# Altium schematic sheet obc-db.SchDoc
size 297 x 209 mm
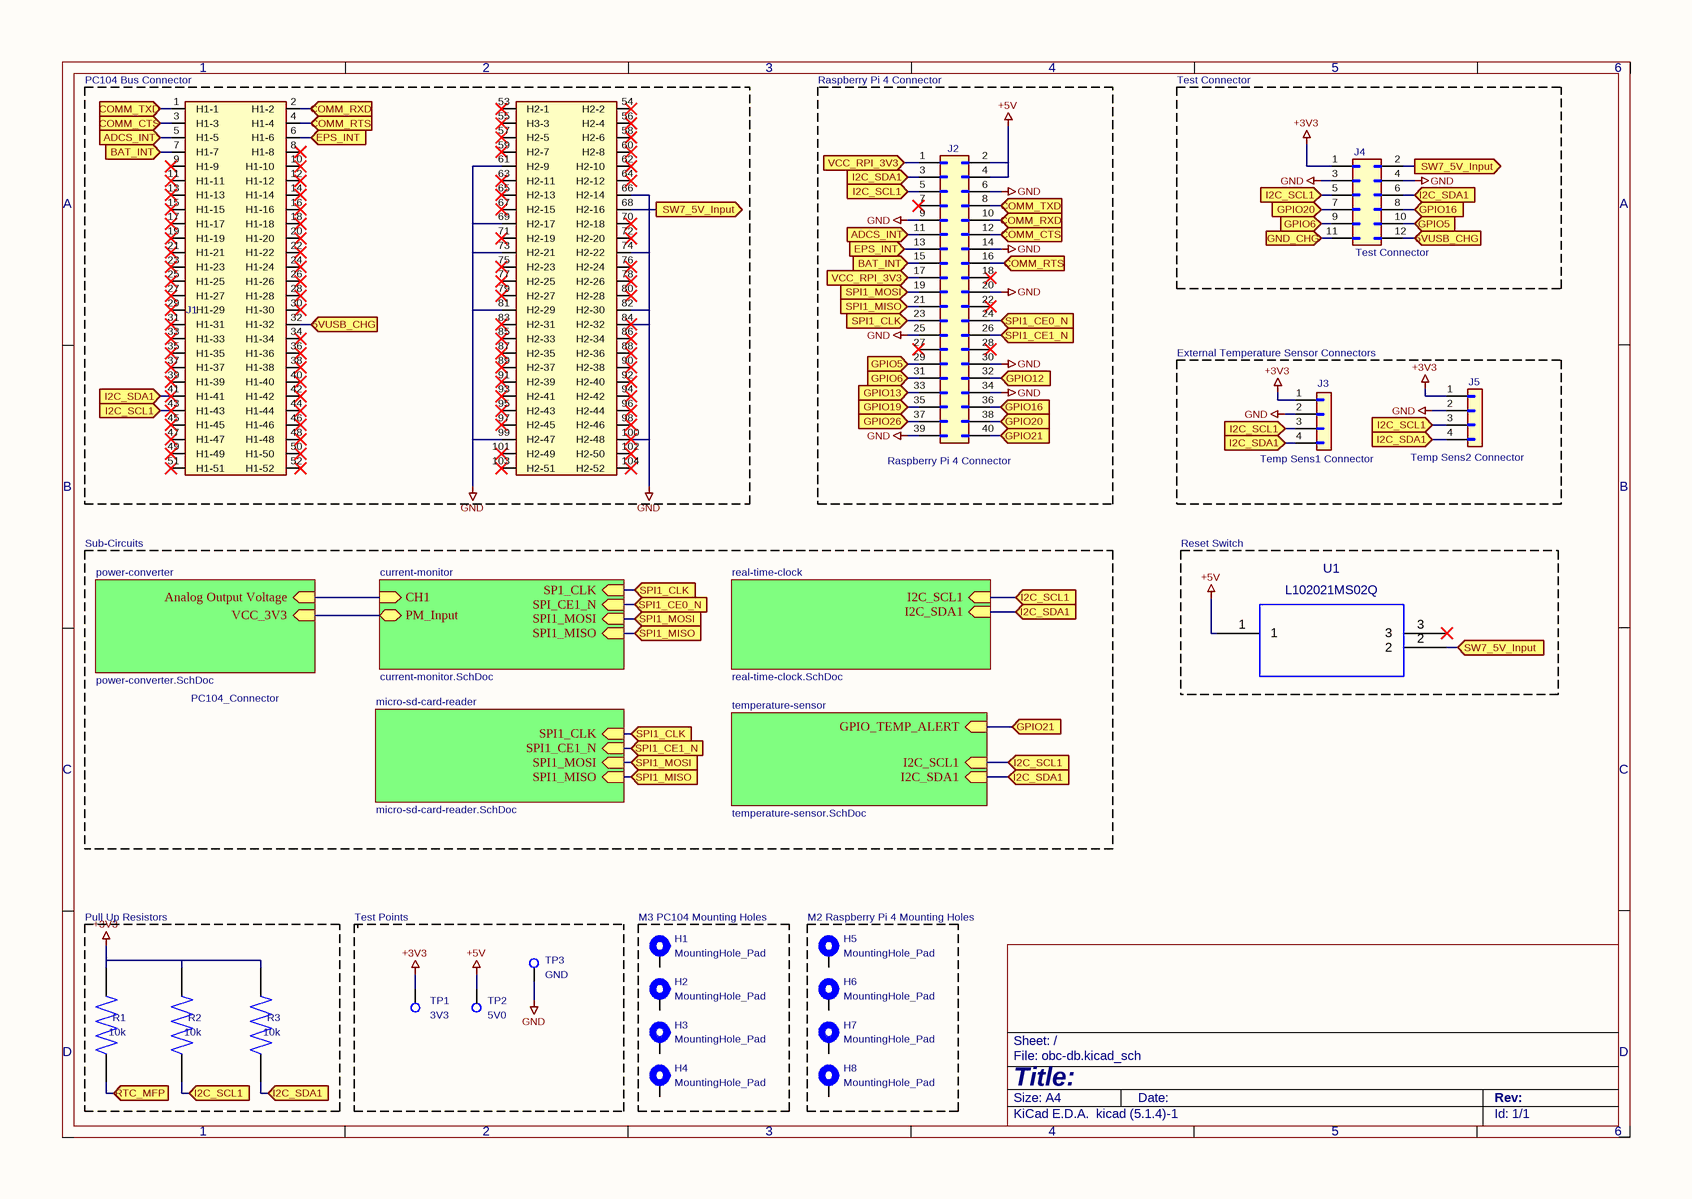
[diagram p0: obc-db.SchDoc]

## Parts
H1  MountingHole_Pad  [MountingHole_3.2mm_M3_Pad_TopBottom]
H2  MountingHole_Pad  [MountingHole_3.2mm_M3_Pad_TopBottom]
H3  MountingHole_Pad  [MountingHole_3.2mm_M3_Pad_TopBottom]
H4  MountingHole_Pad  [MountingHole_3.2mm_M3_Pad_TopBottom]
H5  MountingHole_Pad  [MountingHole_2.2mm_M2_Pad_TopBottom]
H6  MountingHole_Pad  [MountingHole_2.2mm_M2_Pad_TopBottom]
H7  MountingHole_Pad  [MountingHole_2.2mm_M2_Pad_TopBottom]
H8  MountingHole_Pad  [MountingHole_2.2mm_M2_Pad_TopBottom]
J1  PC104_Connector  [pc104-connector]
J2  Raspberry Pi 4 Connector  [PinSocket_2x20_P2.54mm_Vertical]
J3  Temp Sens1 Connector  [PinHeader_1x04_P2.54mm_Vertical]
J4  Test Connector  [PinSocket_2x06_P2.54mm_Horizontal]
J5  Temp Sens2 Connector  [PinHeader_1x04_P2.54mm_Vertical]
R1  10k  [R_0603_1608Metric]
R2  10k  [R_0603_1608Metric]
R3  10k  [R_0603_1608Metric]
TP1  3V3  [TestPoint_Pad_2.0x2.0mm]
TP2  5V0  [TestPoint_Pad_2.0x2.0mm]
TP3  GND  [TestPoint_Pad_2.0x2.0mm]
U1  L102021MS02Q  [L102021MS02Q]

## Blocks framed on the sheet
PC104 Bus Connector: J1
Test Connector: J4
External Temperature Sensor Connectors /: J3 J5
Reset Switch: U1
Pull Up Resistors: R1-R3
Test Points: TP1-TP3
M3 PC104 Mounting Holes /: H1-H4
M2 Raspberry Pi 4 Mounting Holes /: H5-H8

## Sub-sheets
current-monitor = current-monitor.SchDoc: CH1 (in), SPI1_MISO (in), SPI1_MOSI (in), SPI_CE1_N (in), SP1_CLK (in), PM_Input (bidir)
micro-sd-card-reader = micro-sd-card-reader.SchDoc: SPI1_CLK (in), SPI1_MOSI (in), SPI1_MISO (in), SPI1_CE1_N (in)
power-converter = power-converter.SchDoc: Analog Output Voltage (in), VCC_3V3 (in)
real-time-clock = real-time-clock.SchDoc: I2C_SCL1 (in), I2C_SDA1 (in)
temperature-sensor = temperature-sensor.SchDoc: GPIO_TEMP_ALERT (in), I2C_SDA1 (in), I2C_SCL1 (in)

## Ports
5VUSB_CHG (in), ADCS_INT (in), BAT_INT (in), COMM_CTS (in), COMM_RTS (in), COMM_RXD (in), COMM_TXD (in), EPS_INT (in), GND_CHG (in), GPIO5 (in), GPIO6 (in), GPIO12 (in), GPIO13 (in), GPIO16 (in), GPIO19 (in), GPIO20 (in), GPIO21 (in), GPIO26 (in), I2C_SCL1 (in), I2C_SDA1 (in), RTC_MFP (in), SPI1_CE0_N (in), SPI1_CE1_N (in), SPI1_CLK (in), SPI1_MISO (in), SPI1_MOSI (in), SW7_5V_Input (in), SW7_5V_Input (out), VCC_RPI_3V3 (in)

## Nets
+3V3: J3.1(Pin_1) J4.1(Pin_1) J5.1(Pin_1) R1.1 R2.1 R3.1 TP1.1
+5V: J2.2(Pin_2) J2.4(Pin_4) TP2.1 U1.1
GND: J1.61(H2-9) J1.66(H2-14) J1.69(H2-17) J1.73(H2-21) J1.74(H2-22) J1.81(H2-29) J1.82(H2-30) J1.84(H2-32) J1.99(H2-47) J1.100(H2-48) J2.6(Pin_6) J2.9(Pin_9) J2.14(Pin_14) J2.20(Pin_20) J2.25(Pin_25) J2.30(Pin_30) J2.34(Pin_34) J2.39(Pin_39) J3.2(Pin_2) J4.3(Pin_3) J4.4(Pin_4) J5.2(Pin_2) TP3.1
5VUSB_CHG: J1.32(H1-32) J4.12(Pin_12) ; port 5VUSB_CHG
ADCS_INT: J1.5(H1-5) J2.11(Pin_11) ; port ADCS_INT
BAT_INT: J1.7(H1-7) J2.15(Pin_15) ; port BAT_INT
COMM_CTS: J1.3(H1-3) J2.12(Pin_12) ; port COMM_CTS
COMM_RTS: J1.4(H1-4) J2.16(Pin_16) ; port COMM_RTS
COMM_RXD: J1.2(H1-2) J2.10(Pin_10) ; port COMM_RXD
COMM_TXD: J1.1(H1-1) J2.8(Pin_8) ; port COMM_TXD
EPS_INT: J1.6(H1-6) J2.13(Pin_13) ; port EPS_INT
GND_CHG: J4.11(Pin_11) ; port GND_CHG
GPIO5: J2.29(Pin_29) J4.10(Pin_10) ; port GPIO5
GPIO6: J2.31(Pin_31) J4.9(Pin_9) ; port GPIO6
GPIO12: J2.32(Pin_32) ; port GPIO12
GPIO13: J2.33(Pin_33) ; port GPIO13
GPIO16: J2.36(Pin_36) J4.8(Pin_8) ; port GPIO16
GPIO19: J2.35(Pin_35) ; port GPIO19
GPIO20: J2.38(Pin_38) J4.7(Pin_7) ; port GPIO20
GPIO21: J2.40(Pin_40) ; port GPIO21, sheet temperature-sensor/GPIO_TEMP_ALERT
GPIO26: J2.37(Pin_37) ; port GPIO26
I2C_SCL1: J1.43(H1-43) J2.5(Pin_5) J3.3(Pin_3) J4.5(Pin_5) J5.3(Pin_3) R2.2 ; port I2C_SCL1, sheet real-time-clock/I2C_SCL1, sheet temperature-sensor/I2C_SCL1
I2C_SDA1: J1.41(H1-41) J2.3(Pin_3) J3.4(Pin_4) J4.6(Pin_6) J5.4(Pin_4) R3.2 ; port I2C_SDA1, sheet real-time-clock/I2C_SDA1, sheet temperature-sensor/I2C_SDA1
RTC_MFP: R1.2 ; port RTC_MFP
SPI1_CE0_N: J2.24(Pin_24) ; port SPI1_CE0_N, sheet current-monitor/SPI_CE1_N
SPI1_CE1_N: J2.26(Pin_26) ; port SPI1_CE1_N, sheet micro-sd-card-reader/SPI1_CE1_N
SPI1_CLK: J2.23(Pin_23) ; port SPI1_CLK, sheet micro-sd-card-reader/SPI1_CLK, sheet current-monitor/SP1_CLK
SPI1_MISO: J2.21(Pin_21) ; port SPI1_MISO, sheet micro-sd-card-reader/SPI1_MISO, sheet current-monitor/SPI1_MISO
SPI1_MOSI: J2.19(Pin_19) ; port SPI1_MOSI, sheet micro-sd-card-reader/SPI1_MOSI, sheet current-monitor/SPI1_MOSI
SW7_5V_Input: J1.68(H2-16) J4.2(Pin_2) U1.2 ; port SW7_5V_Input
VCC_RPI_3V3: J2.1(Pin_1) J2.17(Pin_17) ; port VCC_RPI_3V3
(unnamed): sheet power-converter/Analog Output Voltage, sheet current-monitor/CH1
(unnamed): sheet power-converter/VCC_3V3, sheet current-monitor/PM_Input

Not connected (* = marked no-connect by the designer): H1 1; H2 1; H3 1; H4 1; H5 1; H6 1; H7 1; H8 1; J1 8(H1-8)* 9(H1-9)* 10(H1-10)* 11(H1-11)* 12(H1-12)* 13(H1-13)* 14(H1-14)* 15(H1-15)* 16(H1-16)* 17(H1-17)* 18(H1-18)* 19(H1-19)* 20(H1-20)* 21(H1-21)* 22(H1-22)* 23(H1-23)* 24(H1-24)* 25(H1-25)* 26(H1-26)* 27(H1-27)* 28(H1-28)* 29(H1-29)* 30(H1-30)* 31(H1-31)* 33(H1-33)* 34(H1-34)* 35(H1-35)* 36(H1-36)* 37(H1-37)* 38(H1-38)* 39(H1-39)* 40(H1-40)* 42(H1-42)* 44(H1-44)* 45(H1-45)* 46(H1-46)* 47(H1-47)* 48(H1-48)* 49(H1-49)* 50(H1-50)* 51(H1-51)* 52(H1-52)* 53(H2-1)* 54(H2-2)* 55(H3-3)* 56(H2-4)* 57(H2-5)* 58(H2-6)* 59(H2-7)* 60(H2-8)* 62(H2-10)* 63(H2-11)* 64(H2-12)* 65(H2-13)* 67(H2-15)* 70(H2-18)* 71(H2-19)* 72(H2-20)* 75(H2-23)* 76(H2-24)* 77(H2-25)* 78(H2-26)* 79(H2-27)* 80(H2-28)* 83(H2-31)* 85(H2-33)* 86(H2-34)* 87(H2-35)* 88(H2-36)* 89(H2-37)* 90(H2-38)* 91(H2-39)* 92(H2-40)* 93(H2-41)* 94(H2-42)* 95(H2-43)* 96(H2-44)* 97(H2-45)* 98(H2-46)* 101(H2-49)* 102(H2-50)* 103(H2-51)* 104(H2-52)*; J2 7(Pin_7)* 18(Pin_18)* 22(Pin_22)* 27(Pin_27)* 28(Pin_28)*; U1 3*

## Notes on the sheet
- Raspberry Pi 4 Connector
- Sub-Circuits
- 1
- 2
- 3
- 4
- 5
- 6
- A
- B
- C
- D
- Title:
- File: obc-db.kicad_sch
- Sheet: /
- KiCad E.D.A.  kicad (5.1.4)-1
- Size: A4
- Date:
- Rev:
- Id: 1/1

## Library data of the parts
J1 = pc104-connector: Value: PC104_Connector; Footprint: pc104-template:pc104-connector
J2 = Conn_02x20_Odd_Even: Value: Raspberry Pi 4 Connector; Footprint: Connector_PinSocket_2.54mm:PinSocket_2x20_P2.54mm_Vertical
J3 J5 = Conn_01x04: Footprint: Connector_PinHeader_2.54mm:PinHeader_1x04_P2.54mm_Vertical
  J3: Value: Temp Sens1 Connector
  J5: Value: Temp Sens2 Connector
J4 = Conn_02x06_Odd_Even: Value: Test Connector; Footprint: Connector_PinSocket_2.54mm:PinSocket_2x06_P2.54mm_Horizontal
R1-R3 = ESR03EZPF1002: Value: 10k; Footprint: Resistor_SMD:R_0603_1608Metric
TP1-TP3 = TestPoint: Footprint: TestPoint:TestPoint_Pad_2.0x2.0mm
  TP1: Value: 3V3
  TP2: Value: 5V0
  TP3: Value: GND
H1-H8 = MountingHole_Pad: Value: MountingHole_Pad
  H1-H4: Footprint: MountingHole:MountingHole_3.2mm_M3_Pad_TopBottom
  H5-H8: Footprint: MountingHole:MountingHole_2.2mm_M2_Pad_TopBottom
U1 = L102021MS02Q: Value: L102021MS02Q; Footprint: qset-footprints:L102021MS02Q